# EasyEDA Pro project AnalyzerBoxPCB_fork_EasyEDA.epro

# Board PCB1
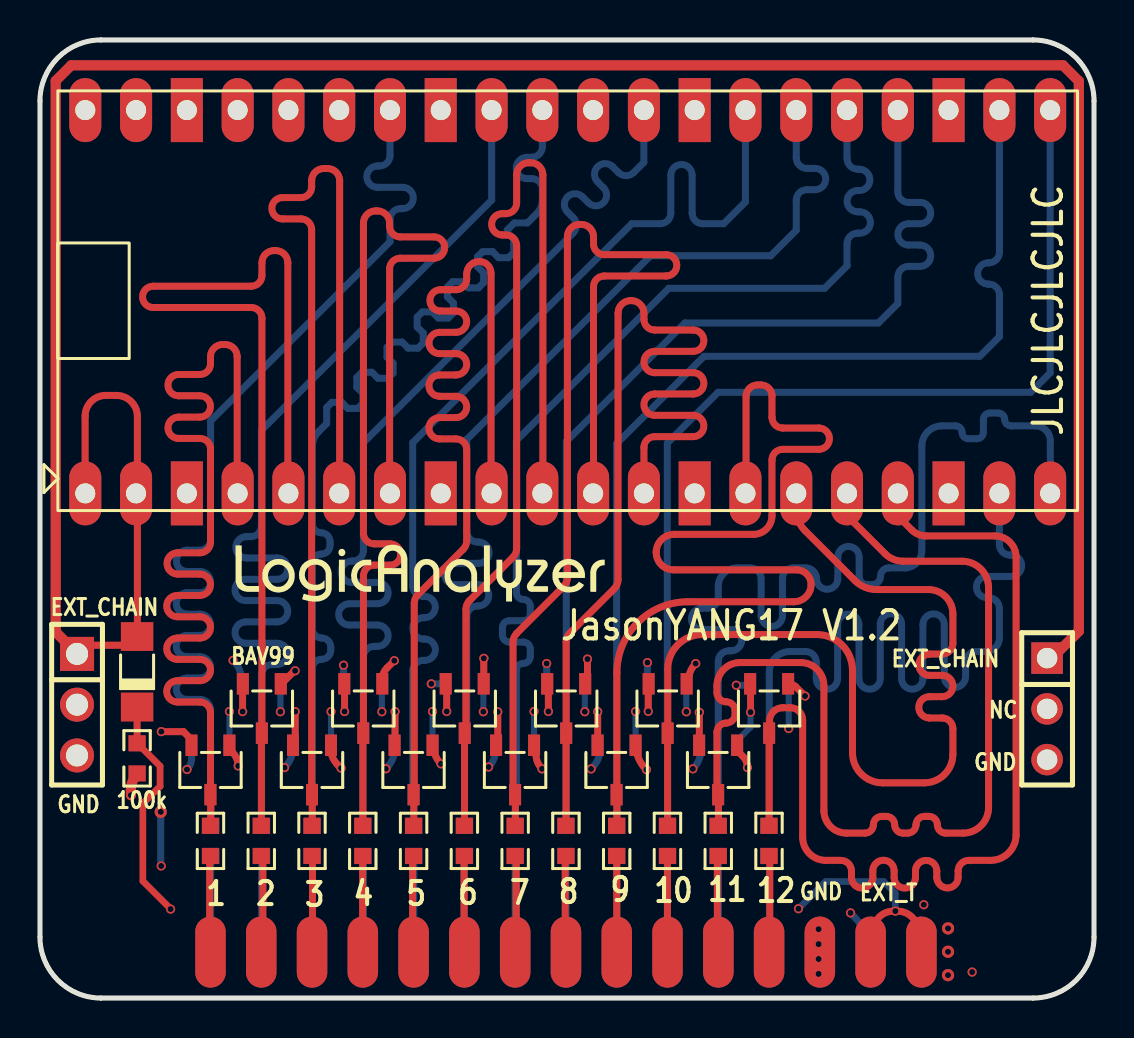
[diagram p0: board, top side]
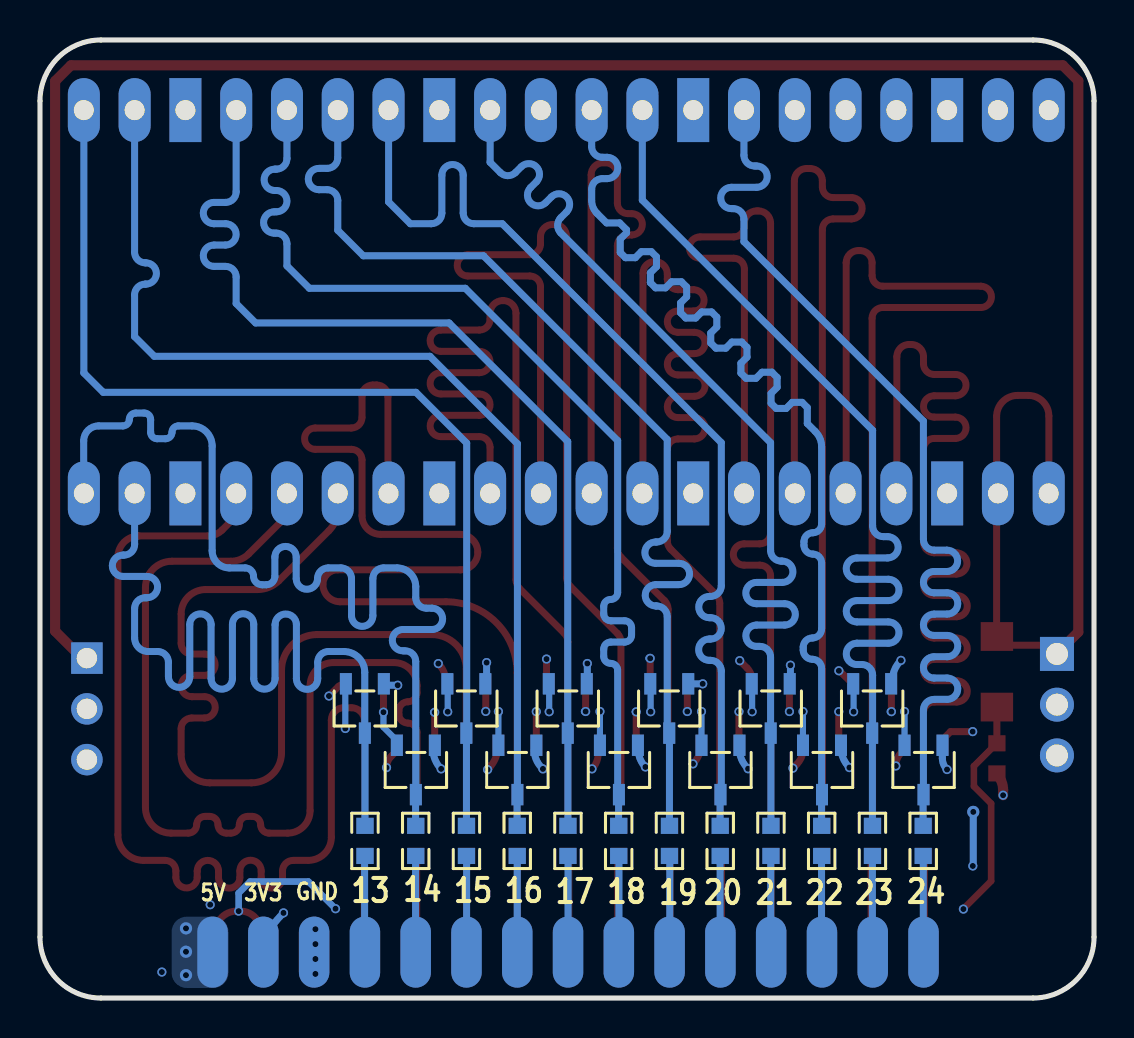
[diagram p1: board, bottom side, seen from below]

Outline 52.72 x 47.94 mm; copper layers: Top Layer, Inner1, Inner2, Bottom Layer. Coordinates in mm from the lower left corner of the outline.
Outline path: 0,44.9 arc(0.89,47.05) 3.05,47.94 49.67,47.94 arc(51.83,47.05) 52.72,44.9 52.72,3.05 arc(51.83,0.89) 49.67,0 3.05,0 arc(0.89,0.89) 0,3.05 0,44.9
Stack: Top Layer 0.035mm 外层铜厚1oz / Dielectric1 0.2104mm 7628 RC49% 8.6mil / Inner1 0.0152mm 内层铜厚 / Dielectric2 1.065mm 1.1mm H/HOZ 含铜 / Inner2 0.0152mm 内层铜厚 / Dielectric3 0.2104mm 7628 RC49% 8.6mil / Bottom Layer 0.035mm 外层铜厚1oz

## Design rules (mm)
template: 自定义配置
spacing copperThickness1oz (default): track to track 0.102, other pairs 0.152 to 0.3
spacing copperThickness2oz: track to track 0.203, other pairs 0.152 to 0.3
track width copperThickness1oz (default): min 0.127, default 0.254, max 2.54
track width copperThickness2oz: min 0.203, default 0.254, max 2.54
differential pair differentialPair (default): width min 0.127, default 0.254, max 2.54; gap min 0.152, default 0.152
via viaSize (default): diameter min 0.406, default 0.457, max 10; hole min 0.3, default 0.305, max 6.299

## Placement (name value [footprint] x y rotation side)
D1  BAV99,215  [SOT-23-3_L2.9-W1.6-P1.90-LS2.8-BR]  11.1 14.49 90 top
D2  FDLL4148  [SOD-80_L3.5-W1.5-RD]  4.86 16.33 90 top
D3  BAV99,215  [SOT-23-3_L2.9-W1.6-P1.90-LS2.8-BR]  13.61 11.41 90 top
D4  BAV99,215  [SOT-23-3_L2.9-W1.6-P1.90-LS2.8-BR]  16.17 14.49 90 top
D5  BAV99,215  [SOT-23-3_L2.9-W1.6-P1.90-LS2.8-BR]  18.68 11.41 90 top
D6  BAV99,215  [SOT-23-3_L2.9-W1.6-P1.90-LS2.8-BR]  21.25 14.49 90 top
D7  BAV99,215  [SOT-23-3_L2.9-W1.6-P1.90-LS2.8-BR]  23.76 11.41 90 top
D8  BAV99,215  [SOT-23-3_L2.9-W1.6-P1.90-LS2.8-BR]  26.32 14.49 90 top
D9  BAV99,215  [SOT-23-3_L2.9-W1.6-P1.90-LS2.8-BR]  28.84 11.41 90 top
D10  BAV99,215  [SOT-23-3_L2.9-W1.6-P1.90-LS2.8-BR]  31.39 14.49 90 top
D11  BAV99,215  [SOT-23-3_L2.9-W1.6-P1.90-LS2.8-BR]  33.92 11.41 90 top
D12  BAV99,215  [SOT-23-3_L2.9-W1.6-P1.90-LS2.8-BR]  36.47 14.49 90 top
D13  BAV99,215  [SOT-23-3_L2.9-W1.6-P1.90-LS2.8-BR]  36.47 14.49 90 bottom
D14  BAV99,215  [SOT-23-3_L2.9-W1.6-P1.90-LS2.8-BR]  33.92 11.41 90 bottom
D15  BAV99,215  [SOT-23-3_L2.9-W1.6-P1.90-LS2.8-BR]  31.39 14.49 90 bottom
D16  BAV99,215  [SOT-23-3_L2.9-W1.6-P1.90-LS2.8-BR]  28.84 11.41 90 bottom
D17  BAV99,215  [SOT-23-3_L2.9-W1.6-P1.90-LS2.8-BR]  26.32 14.49 90 bottom
D18  BAV99,215  [SOT-23-3_L2.9-W1.6-P1.90-LS2.8-BR]  23.76 11.41 90 bottom
D19  BAV99,215  [SOT-23-3_L2.9-W1.6-P1.90-LS2.8-BR]  21.25 14.49 90 bottom
D20  BAV99,215  [SOT-23-3_L2.9-W1.6-P1.90-LS2.8-BR]  18.68 11.41 90 bottom
D21  BAV99,215  [SOT-23-3_L2.9-W1.6-P1.90-LS2.8-BR]  16.17 14.49 90 bottom
D22  BAV99,215  [SOT-23-3_L2.9-W1.6-P1.90-LS2.8-BR]  13.61 11.41 90 bottom
D23  BAV99,215  [SOT-23-3_L2.9-W1.6-P1.90-LS2.8-BR]  11.1 14.49 90 bottom
D24  BAV99,215  [SOT-23-3_L2.9-W1.6-P1.90-LS2.8-BR]  8.53 11.41 90 bottom
D25  BAV99,215  [SOT-23-3_L2.9-W1.6-P1.90-LS2.8-BR]  8.53 11.41 90 top
H1  -  [HDR-TH_3P-P2.54-V-F]  50.37 14.47 270 top
H2  -  [HDR-TH_3P-P2.54-V-M]  1.85 14.68 270 top
R1  100kΩ  [R0603]  4.86 11.99 90 top
R2  220Ω  [R0603]  8.53 7.86 270 top
R3  220Ω  [R0603]  11.07 7.86 270 top
R4  220Ω  [R0603]  13.61 7.86 270 top
R5  220Ω  [R0603]  16.15 7.86 270 top
R6  220Ω  [R0603]  18.69 7.86 270 top
R7  220Ω  [R0603]  21.23 7.86 270 top
R8  220Ω  [R0603]  23.77 7.86 270 top
R9  220Ω  [R0603]  26.31 7.86 270 top
R10  220Ω  [R0603]  28.85 7.86 270 top
R11  220Ω  [R0603]  31.38 7.86 270 top
R12  220Ω  [R0603]  33.93 7.86 270 top
R13  220Ω  [R0603]  36.46 7.86 270 top
R14  220Ω  [R0603]  8.55 7.86 90 bottom
R15  220Ω  [R0603]  11.08 7.86 90 bottom
R16  220Ω  [R0603]  13.62 7.86 90 bottom
R17  220Ω  [R0603]  16.16 7.86 90 bottom
R18  220Ω  [R0603]  18.7 7.86 90 bottom
R19  220Ω  [R0603]  21.24 7.86 90 bottom
R20  220Ω  [R0603]  23.77 7.86 90 bottom
R21  220Ω  [R0603]  26.31 7.86 90 bottom
R22  220Ω  [R0603]  28.85 7.86 90 bottom
R23  220Ω  [R0603]  31.39 7.86 90 bottom
R24  220Ω  [R0603]  33.93 7.86 90 bottom
R25  220Ω  [R0603]  36.46 7.86 90 bottom
U2  -  [树莓派pico多层]  51.8 24.39 90 top
U3  双排针母座2.54 2*15P  [HDR-TH_30P-P2.54-V-F-R2-C15-S2.54-A]  24.98 1.96 90 top

## Footprints (pads in the part's own frame, mm; a bottom-side part is the same pattern mirrored in y, then rotated)
HDR-TH_3P-P2.54-V-F
  rect 1.575x1.575 hole 1.02: 1(-2.54,0)
  round 1.575 hole 1.02: 2(0,0) 3(2.54,0)
HDR-TH_3P-P2.54-V-M
  rect 1.7x1.7 hole 1.1: 1(-2.54,0)
  round 1.7 hole 1.1: 2(0,0) 3(2.54,0)
HDR-TH_30P-P2.54-V-F-R2-C15-S2.54-A
  oval 3.556x1.524 smd: 1(0.337,16.453) 2(0.337,13.914) 3(0.337,11.373) 4(0.337,8.834) 5(0.337,6.293) 6(0.337,3.753) 7(0.337,1.214) 8(0.337,-1.327) 9(0.337,-3.866) 10(0.337,-6.407) 11(0.337,-8.947) 12(0.337,-11.486) 13(0.337,-14.027) 14(0.337,-16.567) 15(0.337,-19.107)
  oval 3.556x1.524 smd far side: 16(0.337,-19.107) 17(0.337,-16.567) 18(0.337,-14.027) 19(0.337,-11.486) 20(0.337,-8.947) 21(0.337,-6.407) 22(0.337,-3.866) 23(0.337,-1.327) 24(0.337,1.214) 25(0.337,3.753) 26(0.337,6.293) 27(0.337,8.834) 28(0.337,11.373) 29(0.337,13.914) 30(0.337,16.453)
R0603
  rect 0.806x0.864 smd: 1(-0.753,0) 2(0.753,0)
SOD-80_L3.5-W1.5-RD
  rect 1.44x1.62 smd: 1(-1.765,0) 2(1.765,0)
SOT-23-3_L2.9-W1.6-P1.90-LS2.8-BR
  rect 1.07x0.6 smd: 1(1.235,-0.95) 2(1.235,0.95) 3(-1.235,0)
树莓派pico多层
  oval 3.2x1.6 hole 1: 1(0.86,49.529) 2(0.86,46.99) 4(0.86,41.91) 5(0.86,39.37) 6(0.86,36.83) 7(0.86,34.289) 9(0.86,29.209) 10(0.86,26.669) 11(0.86,24.13) 12(0.86,21.59) 14(0.86,16.509) 15(0.86,13.97) 16(0.86,11.43) 17(0.86,8.889) 19(0.86,3.809) 20(0.86,1.27) 21(20.04,1.27) 22(20.04,3.809) 24(20.04,8.889) 25(20.04,11.43) 26(20.04,13.97) 27(20.04,16.509) 29(20.04,21.59) 30(20.04,24.13) 31(20.04,26.669) 32(20.04,29.209) 34(20.04,34.289) 35(20.04,36.83) 36(20.04,39.37) 37(20.04,41.91) 39(20.04,46.989) 40(20.04,49.529)
  rect 3.2x1.6 hole 1: 3(0.86,44.45) 8(0.86,31.75) 13(0.86,19.049) 18(0.86,6.349) 23(20.04,6.349) 28(20.04,19.049) 33(20.04,31.75) 38(20.04,44.45)

## Nets
+3.3V: D1.2 D3.2 D4.2 D5.2 D6.2 D7.2 D8.2 D9.2 D10.2 D11.2 D12.2 D13.2 D14.2 D15.2 D16.2 D17.2 D18.2 D19.2 D20.2 D21.2 D22.2 D23.2 D24.2 D25.2 U2.36 U3.17
+5V: U2.40 U3.16
GND: D1.1 D3.1 D4.1 D5.1 D6.1 D7.1 D8.1 D9.1 D10.1 D11.1 D12.1 D13.1 D14.1 D15.1 D16.1 D17.1 D18.1 D19.1 D20.1 D21.1 D22.1 D23.1 D24.1 D25.1 H1.3 H2.3 R1.1 U2.3 U2.8 U2.13 U2.18 U2.23 U2.28 U2.38 U3.13 U3.18
CHAN_0: D25.3 R2.1 U2.4
CHAN_1: D1.3 R3.1 U2.5
CHAN_2: D3.3 R4.1 U2.6
CHAN_3: D4.3 R5.1 U2.7
CHAN_4: D5.3 R6.1 U2.9
CHAN_5: D6.3 R7.1 U2.10
CHAN_6: D7.3 R8.1 U2.11
CHAN_7: D8.3 R9.1 U2.12
CHAN_8: D9.3 R10.1 U2.14
CHAN_9: D10.3 R11.1 U2.15
CHAN_10: D11.3 R12.1 U2.16
CHAN_11: D12.3 R13.1 U2.17
CHAN_12: D13.3 R25.2 U2.19
CHAN_13: D14.3 R24.2 U2.20
CHAN_14: D15.3 R23.2 U2.21
CHAN_15: D16.3 R22.2 U2.22
CHAN_16: D17.3 R21.2 U2.24
CHAN_17: D18.3 R20.2 U2.25
CHAN_18: D19.3 R19.2 U2.26
CHAN_19: D20.3 R18.2 U2.27
CHAN_20: D21.3 R17.2 U2.29
CHAN_21: D22.3 R16.2 U2.31
CHAN_22: D23.3 R15.2 U2.32
CHAN_23: D24.3 R14.2 U2.34
EXT_CHAIN: D2.2 H1.1 H2.1 U2.1 U2.2
EXT_T: D2.1 R1.2 U3.14 U3.15
$1N6412: R2.2 U3.1
$1N6457: R3.2 U3.2
$1N6576: R4.2 U3.3
$1N6580: R5.2 U3.4
$1N6666: R6.2 U3.5
$1N6670: R7.2 U3.6
$1N6756: R8.2 U3.7
$1N6760: R9.2 U3.8
$1N6846: R10.2 U3.9
$1N6850: R11.2 U3.10
$1N6936: R12.2 U3.11
$1N6940: R13.2 U3.12
$1N7395: R25.1 U3.19
$1N7399: R24.1 U3.20
$1N7403: R23.1 U3.21
$1N7407: R22.1 U3.22
$1N7411: R21.1 U3.23
$1N7415: R20.1 U3.24
$1N7419: R19.1 U3.25
$1N7423: R18.1 U3.26
$1N7427: R17.1 U3.27
$1N7431: R16.1 U3.28
$1N7435: R15.1 U3.29
$1N7439: R14.1 U3.30

Pads without a net: H1 2; H2 2; U2 30 33 35 37 39

## Via types
v1: diameter 0.457, hole 0.305, Top Layer to Bottom Layer, 59 vias
v2: diameter 0.61, hole 0.305, Top Layer to Bottom Layer, 4 vias

## Routing (per net, layer and track width the routed paths; a pad name or vN(x,y) marks a point on that pad's centre or on a via; arc(x,y) is an arc through that point)
+3.3V: length 152.4
  Top Layer w0.349: 25.43,15.79 v1(25.43,14.34) ; v1(35.54,14.31) 35.54,15.66 ; 22.82,12.8 22.9,12.89 v1(22.9,14.32) ; 30.42,15.66 v1(30.42,14.34) ; 20.34,15.49 v1(20.34,14.34) ; 17.76,12.7 v1(17.76,14.33) ; 12.65,12.62 12.77,12.74 v1(12.77,14.33) ; 15.23,15.76 v1(15.23,14.34) ; 7.54,12.61 7.54,12.96 7.18,13.33 v1(6.07,13.33) ; 27.9,12.7 v1(27.9,14.33) ; 10.13,15.75 v1(10.13,14.33) ; 32.98,12.57 v1(32.98,14.3)
  Inner2 w0.349: v1(6.06,6.61) 7.01,5.66 39.14,5.66 v1(40.54,4.26)
  Inner2 w0.508: 6.05,13.01 6.05,15.65 ; 6.05,13.01 6.05,9.33 v2(6.04,9.31) ; 6.05,13.01 arc(6.06,13.17) 6.09,13.33 arc(6.56,14.05) 7.37,14.33 arc(6.44,14.72) 6.05,15.65 ; 6.05,15.65 6.05,34.87 12.43,41.24 12.43,44.43
  Inner2 w0.762: v1(37.45,13.49) 36.61,14.33 v1(27.25,14.33) 6.4,14.33
  Bottom Layer w0.305: v1(19.63,14.34) 19.63,12.51 ; v1(17.1,14.33) 17.1,15.71 17.12,15.73 ; v1(37.45,13.49) 37.45,15.7 37.42,15.73 ; v1(9.48,14.34) 9.48,12.51 ; 27.27,15.73 27.25,15.71 v1(27.25,14.33) ; v1(35.54,14.31) 35.54,13.56 34.87,12.88 34.87,12.51 ; 32.34,15.72 32.33,15.71 v1(32.33,14.33) ; v1(12.02,14.33) 12.02,15.71 12.04,15.72 ; v1(29.79,14.34) 29.79,12.51 ; v1(14.56,14.34) 14.56,12.51 ; 22.19,15.73 22.18,15.71 v1(22.18,14.33) ; v1(24.71,14.34) 24.71,12.51
  Bottom Layer w0.349: v1(25.43,14.34) 25.49,14.34 ; v1(10.13,14.33) 10.2,14.33 ; v1(32.98,14.3) 33.04,14.3 ; v1(12.77,14.33) 12.78,14.33 ; v2(6.04,9.31) 6.04,6.63 v1(6.06,6.61) ; v1(17.76,14.33) 17.78,14.33 ; v1(22.9,14.32) 22.95,14.32 ; v1(20.34,14.34) 20.33,14.34 ; v1(6.07,13.33) 6.07,13.31 ; v1(27.9,14.33) 27.9,14.33 ; v1(40.54,4.26) arc(41.11,3.61) 41.57,2.88
+5V: length 82.8
  Inner2 w0.508: v2(45.42,3.49) 45.42,5.19 43.62,6.99 7.83,6.99 7.02,7.79 4.62,7.79 3.5,8.91 3.5,42.34 2.14,43.7
  Inner2 w0.61: v2(45.42,1.15) v2(45.42,2.32) v2(45.42,3.49)
GND: length 27.6
  Top Layer w0.349: 12.1,15.75 12.67,16.32 arc(12.72,16.35) 12.78,16.36 ; v1(30.33,11.43) 30.29,11.47 arc(29.94,12) 29.81,12.64 ; v1(34.83,15.65) 34.83,15.68 ; 27.38,15.93 v1(27.38,16.96) ; v1(15.06,11.5) 14.88,11.68 arc(14.63,12.06) 14.54,12.5 ; v1(19.57,15.72) 19.57,15.7 ; v1(25.34,16.74) 25.33,16.74 ; 9.43,12.5 9.63,12.3 arc(9.84,11.98) v1(9.91,11.61) ; 22.2,15.81 v1(22.2,17) ; 32.43,15.71 32.43,15.86 arc(32.53,16.33) v1(32.8,16.74) ; v1(9.66,16.9) 9.65,16.9 ; 24.81,12.54 24.81,12.21 arc(24.88,11.81) v1(25.11,11.47) ; v1(30.38,16.79) 30.43,16.79 ; 34.82,12.43 35.15,12.1 arc(35.33,11.84) v1(35.39,11.53) ; v1(38.27,15.11) 37.8,15.58 arc(37.65,15.68) 37.48,15.71 ; v1(17.72,16.88) 17.36,16.52 arc(17.16,16.23) 17.1,15.89 ; 19.66,12.69 arc(19.76,12.16) v1(20.06,11.72)
  Top Layer w0.508: v1(4.55,10.15) 4.55,10.41 arc(4.64,10.85) 4.89,11.23
  Bottom Layer w0.349: 12.66,12.58 12.66,12.57 arc(12.55,12.01) v1(12.23,11.53) ; 20.26,15.72 v1(19.57,15.72) ; 22.79,12.5 22.79,12.41 arc(22.7,11.95) v1(22.44,11.56) ; 30.38,15.61 v1(30.38,16.79) ; 15.18,15.67 v1(15.18,16.66) ; 33.06,12.67 33.06,12.45 arc(32.96,11.92) v1(32.66,11.47) ; 25.34,15.77 v1(25.34,16.74) ; v1(27.56,11.47) 27.62,11.52 arc(27.9,11.95) 28,12.44 ; v1(27.38,16.96) 27.34,16.96 ; 7.59,12.69 7.59,12 arc(7.53,11.7) v1(7.35,11.44) ; v1(22.2,17) 22.27,17 ; v1(9.66,16.9) 9.67,16.89 arc(9.98,16.42) 10.09,15.87 ; 35.57,15.65 v1(34.83,15.65) ; v1(17.3,11.47) 17.32,11.5 arc(17.64,11.97) 17.75,12.53
  vias: v1(12.76,16.38) v1(38.94,3.45) v1(38.94,2.7) v1(38.94,1.95) v1(38.94,1.21) v1(44.21,4.67) v1(46.62,1.3)
CHAN_0: length 53.1
  Top Layer w0.349: 8.54,8.62 8.54,10.19 ; 9.86,25.27 9.86,32.1 arc(9.68,32.53) 9.25,32.71 9.14,32.71 arc(8.71,32.53) 8.53,32.1 8.53,31.74 arc(8.37,31.36) 8,31.21 6.93,31.21 arc(6.4,30.67) 6.93,30.14 8,30.14 arc(8.53,29.6) 8,29.07 6.93,29.07 arc(6.4,28.54) 6.93,28 8,28 arc(8.37,27.85) 8.53,27.47 8.53,22.81 arc(8.37,22.44) 8,22.28 6.89,22.28 arc(6.35,21.75) 6.89,21.21 8,21.21 arc(8.53,20.68) 8,20.15 6.87,20.15 arc(6.34,19.61) 6.87,19.08 8,19.08 arc(8.53,18.55) 8,18.01 6.87,18.01 arc(6.34,17.48) 6.87,16.95 8,16.95 arc(8.53,16.41) 8,15.88 6.87,15.88 arc(6.34,15.35) 6.87,14.81 8,14.81 arc(8.37,14.66) 8.53,14.28 8.53,9.94
CHAN_1: length 53.1
  Top Layer w0.349: 12.4,25.25 12.4,36.8 arc(12.22,37.23) 11.79,37.41 11.71,37.41 arc(11.28,37.23) 11.1,36.8 11.1,36.16 arc(10.94,35.78) 10.57,35.62 5.66,35.62 arc(5.13,35.09) 5.66,34.56 10.57,34.56 arc(10.94,34.4) 11.1,34.02 11.1,12.9 ; 11.07,8.62 11.07,13.27
CHAN_2: length 53.1
  Top Layer w0.349: 14.99,25.27 14.99,40.9 arc(14.81,41.33) 14.38,41.51 14.2,41.51 arc(13.77,41.33) 13.59,40.9 13.59,40.59 arc(13.43,40.21) 13.05,40.06 12.13,40.06 arc(11.6,39.52) 12.13,38.99 13.05,38.99 arc(13.43,38.83) 13.59,38.46 13.59,10.17 ; 13.62,8.62 13.62,10.19
CHAN_3: length 53.1
  Top Layer w0.349: 16.15,8.62 16.15,13.26 ; 16.15,13.26 16.18,13.28 16.18,21.13 arc(16.33,21.51) 16.71,21.66 17.51,21.66 arc(18.04,22.2) 17.51,22.73 16.71,22.73 arc(16.33,22.89) 16.18,23.26 16.18,38.78 arc(16.36,39.21) 16.79,39.39 16.88,39.39 arc(17.31,39.21) 17.49,38.78 17.49,38.62 arc(17.64,38.25) 18.02,38.09 19.71,38.09 arc(20.24,37.56) 19.71,37.02 18.02,37.02 arc(17.64,36.87) 17.49,36.49 17.49,25.26 ; 16.15,13.26 16.13,13.24
CHAN_4: length 53.1
  Top Layer w0.349: 22.56,25.31 22.56,36.27 arc(22.39,36.69) 21.97,36.86 arc(21.53,36.67) 21.34,36.23 21.34,35.98 arc(21.19,35.6) 20.81,35.45 20.04,35.45 arc(19.5,34.91) 20.04,34.38 20.81,34.38 arc(21.34,33.85) 20.81,33.31 19.99,33.31 arc(19.46,32.78) 19.99,32.25 20.81,32.25 arc(21.34,31.71) 20.81,31.18 19.99,31.18 arc(19.46,30.65) 19.99,30.11 20.81,30.11 arc(21.34,29.58) 20.81,29.05 19.99,29.05 arc(19.46,28.51) 19.99,27.98 20.81,27.98 arc(21.19,27.82) 21.34,27.45 21.34,22.88 arc(21.3,22.65) 21.16,22.45 18.9,20.18 arc(18.77,19.99) 18.72,19.75 18.72,9.95 ; 18.7,8.62 18.7,10.19
CHAN_5: length 53.1
  Top Layer w0.349: 21.23,8.62 21.23,13.27 ; 25.15,25.26 25.15,41.19 arc(24.98,41.62) 24.54,41.8 24.45,41.8 arc(24.02,41.62) 23.84,41.19 23.84,39.79 arc(23.68,39.41) 23.31,39.25 23.12,39.25 arc(22.59,38.72) 23.12,38.19 23.31,38.19 arc(23.68,38.03) 23.84,37.65 23.84,22.5 arc(23.79,22.26) 23.66,22.07 21.48,19.89 arc(21.35,19.69) 21.3,19.46 21.3,13.26
CHAN_6: length 53.1
  Top Layer w0.349: 23.78,8.62 23.78,10.19 ; 23.66,9.89 23.66,17.82 arc(23.71,18.05) 23.84,18.25 26.2,20.61 arc(26.33,20.81) 26.38,21.04 26.38,38.1 arc(26.56,38.53) 26.99,38.71 27.08,38.71 arc(27.51,38.53) 27.69,38.1 27.69,37.73 arc(27.84,37.36) 28.22,37.2 31.32,37.2 arc(31.85,36.67) 31.32,36.13 28.22,36.13 arc(27.84,35.98) 27.69,35.6 27.69,25.27
CHAN_7: length 53.1
  Top Layer w0.349: 30.21,25.23 30.21,27.56 arc(30.36,27.94) 30.74,28.09 32.67,28.09 arc(33.21,28.63) 32.67,29.16 30.74,29.16 arc(30.21,29.69) 30.74,30.23 32.67,30.23 arc(33.21,30.76) 32.67,31.29 30.74,31.29 arc(30.21,31.83) 30.74,32.36 32.67,32.36 arc(33.21,32.9) 32.67,33.43 30.74,33.43 arc(30.36,33.58) 30.21,33.96 30.21,34.27 arc(30.02,34.72) 29.57,34.9 29.55,34.9 arc(29.1,34.72) 28.91,34.27 28.91,20.93 arc(28.86,20.69) 28.73,20.49 26.5,18.26 arc(26.37,18.06) 26.32,17.81 26.32,13.13 ; 26.31,8.62 26.31,13.27
CHAN_8: length 53.2
  Top Layer w0.349: 28.86,10.17 28.86,16.28 arc(29.9,18.79) 32.41,19.83 37.7,19.83 arc(38.31,20.08) 38.57,20.69 arc(38.35,21.21) 37.84,21.43 31.69,21.43 arc(31.08,21.68) 30.82,22.3 arc(31.08,22.94) 31.72,23.2 35.68,23.2 arc(36.34,23.48) 36.61,24.14 36.61,26.93 arc(36.77,27.3) 37.15,27.46 38.95,27.46 arc(39.49,27.99) 38.95,28.53 37.15,28.53 arc(36.77,28.68) 36.61,29.06 36.61,30.14 arc(36.45,30.52) 36.07,30.68 35.88,30.68 arc(35.48,30.51) 35.32,30.11 35.32,25.19 ; 28.86,10.17 28.91,10.12 ; 28.86,10.17 28.86,8.62
CHAN_9: length 53.1
  Top Layer w0.349: 31.4,13.31 31.4,16.46 arc(31.91,17.68) 33.13,18.19 38.86,18.19 arc(40.12,17.67) 40.64,16.41 40.64,12.28 arc(41.08,11.21) 42.14,10.77 44.23,10.77 arc(45.24,11.19) 45.66,12.2 45.66,13.48 arc(45.5,13.86) 45.13,14.01 44.49,14.01 arc(43.95,14.55) 44.49,15.08 45.13,15.08 arc(45.66,15.61) 45.13,16.15 44.49,16.15 arc(43.96,16.68) 44.49,17.21 45.13,17.21 arc(45.5,17.37) 45.66,17.75 45.66,19.22 arc(45.3,20.08) 44.44,20.44 41.84,20.44 arc(41.26,20.56) 40.77,20.89 38.27,23.38 arc(37.94,23.88) 37.83,24.46 U2.15 ; 31.39,8.62 31.39,13.27
CHAN_10: length 53.1
  Top Layer w0.349: U2.16 40.37,24.66 arc(40.46,24.18) 40.74,23.77 42.27,22.23 arc(42.69,21.96) 43.17,21.86 46.12,21.86 arc(47.06,21.47) 47.44,20.54 47.44,9.53 arc(47.07,8.63) 46.17,8.25 45.3,8.25 arc(45.01,8.37) 44.88,8.67 arc(44.76,8.97) 44.46,9.09 44.24,9.09 arc(43.94,8.97) 43.82,8.67 arc(43.69,8.37) 43.4,8.25 43.17,8.25 arc(42.87,8.37) 42.75,8.67 arc(42.63,8.97) 42.33,9.09 42.1,9.09 arc(41.81,8.97) 41.68,8.67 arc(41.56,8.37) 41.26,8.25 40.34,8.25 arc(39.54,8.58) 39.21,9.38 39.21,15.62 arc(38.87,16.45) 38.04,16.79 35.02,16.79 arc(34.2,16.45) 33.86,15.63 33.86,15.28 arc(33.99,14.96) 34.32,14.83 arc(34.64,14.69) 34.77,14.37 34.77,14.21 arc(34.64,13.89) 34.32,13.76 arc(33.99,13.63) 33.86,13.31 33.86,10.37 ; 33.94,8.62 33.94,10.19
CHAN_11: length 53
  Top Layer w0.349: U2.17 42.91,24.54 arc(42.98,24.16) 43.2,23.83 43.61,23.42 arc(43.94,23.2) 44.33,23.12 47.76,23.12 arc(48.51,22.81) 48.82,22.07 48.82,8.17 arc(48.45,7.26) 47.54,6.89 46.46,6.89 arc(46.08,6.73) 45.92,6.36 45.92,6.04 arc(45.39,5.5) 44.86,6.04 44.86,6.36 arc(44.32,6.89) 43.79,6.36 43.79,6.04 arc(43.26,5.5) 42.72,6.04 42.72,6.36 arc(42.19,6.89) 41.66,6.36 41.66,6.04 arc(41.12,5.5) 40.59,6.04 40.59,6.36 arc(40.43,6.73) 40.06,6.89 39.31,6.89 arc(38.49,7.23) 38.15,8.05 38.15,13.91 arc(37.97,14.35) 37.53,14.53 37.14,14.53 arc(36.68,14.34) 36.49,13.88 36.49,13.24 ; 36.47,8.62 36.47,13.26
CHAN_12: length 53.1
  Bottom Layer w0.349: 47.99,25.25 47.99,22.7 arc(48.14,22.32) 48.52,22.17 48.57,22.17 arc(49.1,21.63) 48.57,21.1 47.37,21.1 arc(46.84,20.57) 47.37,20.03 47.45,20.03 arc(47.83,19.88) 47.99,19.5 47.99,18.01 arc(47.79,17.54) 47.31,17.34 46.83,17.34 arc(46.45,17.18) 46.3,16.81 46.3,16.08 arc(45.76,15.55) 45.23,16.08 45.23,18.69 arc(44.7,19.22) 44.16,18.69 44.16,15.99 arc(43.63,15.46) 43.09,15.99 43.09,18.69 arc(42.56,19.22) 42.03,18.69 42.03,15.99 arc(41.5,15.46) 40.96,15.99 40.96,18.69 arc(40.43,19.22) 39.9,18.69 39.89,15.99 arc(39.36,15.46) 38.83,15.99 38.83,16.81 arc(38.67,17.18) 38.29,17.34 37.52,17.34 arc(36.78,17.03) 36.48,16.3 36.48,13.26 ; 36.47,8.62 36.47,13.29
CHAN_13: length 53.1
  Bottom Layer w0.349: 33.93,8.62 33.93,10.18 ; 33.93,10.19 33.93,16.84 arc(34.08,17.22) 34.46,17.37 34.56,17.37 arc(35.1,17.91) 34.56,18.44 33.11,18.44 arc(32.58,18.98) 33.11,19.51 33.39,19.51 arc(33.77,19.66) 33.93,20.04 33.93,20.59 arc(34.2,21.25) 34.86,21.52 35.54,21.52 arc(35.91,21.37) 36.07,20.99 36.07,19.14 arc(36.6,18.61) 37.14,19.14 37.14,20.99 arc(37.29,21.37) 37.67,21.52 38.3,21.52 arc(38.68,21.37) 38.84,20.99 38.84,20.98 arc(39.37,20.45) 39.9,20.98 39.9,22.07 arc(40.44,22.6) 40.97,22.07 40.97,21.1 arc(41.09,20.81) 41.39,20.68 41.62,20.68 arc(41.91,20.81) 42.04,21.1 arc(42.16,21.4) 42.46,21.52 43.25,21.52 arc(43.86,21.78) 44.11,22.38 44.11,27.63 arc(44.4,28.34) 45.11,28.63 45.8,28.63 arc(46.02,28.54) 46.12,28.31 arc(46.21,28.08) 46.44,27.99 46.86,27.99 arc(47.09,28.08) 47.19,28.31 47.19,28.95 arc(47.28,29.18) 47.51,29.27 47.93,29.27 arc(48.16,29.18) 48.25,28.95 arc(48.35,28.73) 48.57,28.63 49.79,28.63 arc(50.32,28.41) 50.53,27.89 50.53,25.26
CHAN_14: length 53.1
  Bottom Layer w0.349: 50.53,44.44 50.53,31.28 49.56,30.31 33.91,30.31 31.38,27.77 31.38,13.08 ; 31.39,8.62 31.39,13.29
CHAN_15: length 53.1
  Bottom Layer w0.349: 28.84,10.18 28.84,27.74 33.21,32.11 47,32.11 47.99,33.1 47.99,35.19 arc(47.83,35.57) 47.46,35.73 47.43,35.73 arc(46.9,36.26) 47.43,36.79 47.46,36.79 arc(47.83,36.95) 47.99,37.33 47.99,44.43 ; 28.86,8.62 28.86,10.18
CHAN_16: length 53.1
  Bottom Layer w0.349: 26.31,8.62 26.31,13.29 ; 26.32,13.26 26.32,27.85 32.26,33.78 41.93,33.78 42.91,34.76 42.91,36.08 arc(43.06,36.46) 43.44,36.61 44.02,36.61 arc(44.55,37.15) 44.02,37.68 43.44,37.68 arc(42.91,38.21) 43.44,38.75 44.02,38.75 arc(44.55,39.28) 44.02,39.82 43.44,39.82 arc(43.06,39.97) 42.91,40.35 42.91,44.43
CHAN_17: length 53.1
  Bottom Layer w0.349: 40.37,44.44 40.37,42.01 arc(40.52,41.63) 40.9,41.48 40.98,41.48 arc(41.51,40.94) 40.98,40.41 40.9,40.41 arc(40.37,39.88) 40.9,39.34 41,39.34 arc(41.54,38.81) 41,38.28 40.9,38.28 arc(40.52,38.12) 40.37,37.74 40.37,36.64 39.25,35.52 31.45,35.52 23.83,27.9 23.83,20.3 arc(23.93,20.05) 24.17,19.95 arc(24.42,19.84) 24.52,19.6 24.52,19.23 arc(24.42,18.98) 24.17,18.88 23.48,18.88 arc(23.23,18.78) 23.13,18.53 23.13,18.16 arc(23.23,17.92) 23.48,17.81 24.17,17.81 arc(24.42,17.71) 24.52,17.47 24.52,17.09 arc(24.42,16.85) 24.17,16.75 arc(23.93,16.64) 23.83,16.4 23.83,10.11 ; 23.78,8.62 23.78,10.18
CHAN_18: length 53.1
  Bottom Layer w0.349: 21.35,13.2 21.35,19.09 arc(21.5,19.46) 21.88,19.62 21.91,19.62 arc(22.45,20.15) 21.91,20.69 20.76,20.69 arc(20.23,21.22) 20.76,21.75 21.93,21.75 arc(22.46,22.29) 21.93,22.82 21.88,22.82 arc(21.5,22.98) 21.35,23.35 21.35,27.96 30.54,37.14 36.55,37.14 37.83,38.42 37.83,39.92 arc(37.98,40.3) 38.36,40.45 38.77,40.45 arc(39.3,40.98) 38.77,41.52 38.36,41.52 arc(37.98,41.67) 37.83,42.05 37.83,44.43 ; 21.24,8.62 21.24,13.29
CHAN_19: length 53.1
  Bottom Layer w0.349: 35.28,44.43 35.28,39.84 34.19,38.75 33.15,38.75 arc(32.78,38.9) 32.62,39.28 32.62,41.18 arc(32.09,41.71) 31.55,41.18 31.55,39.28 arc(31.4,38.9) 31.02,38.75 29.6,38.75 18.64,27.79 18.64,20.63 arc(18.8,20.26) 19.18,20.1 19.24,20.1 arc(19.77,19.57) 19.24,19.03 19.18,19.03 arc(18.64,18.5) 19.18,17.97 19.24,17.97 arc(19.78,17.43) 19.24,16.9 19.18,16.9 arc(18.8,16.74) 18.64,16.37 18.64,10.2 ; 18.7,8.62 18.7,10.18
CHAN_20: length 53.1
  Bottom Layer w0.349: 16.16,8.62 16.16,13.29 ; 30.21,44.43 30.21,41.82 29.69,41.31 arc(29.32,41.15) 28.94,41.31 28.65,41.6 arc(27.89,41.6) 27.89,40.85 28.18,40.55 arc(28.18,39.8) 27.43,39.8 27.14,40.09 arc(26.38,40.09) 26.38,39.34 26.68,39.05 arc(26.83,38.67) 26.68,38.29 16.18,27.79 16.18,22.4 arc(16.02,22.02) 15.64,21.87 15.59,21.87 arc(15.06,21.33) 15.59,20.8 16.88,20.8 arc(17.42,20.27) 16.88,19.73 15.47,19.73 arc(14.94,19.2) 15.47,18.67 16.88,18.67 arc(17.42,18.13) 16.88,17.6 16.71,17.6 arc(16.33,17.44) 16.18,17.06 16.18,13.25
CHAN_21: length 53.1
  Bottom Layer w0.349: 25.13,44.44 25.13,42.61 arc(24.97,42.23) 24.59,42.07 24.35,42.07 arc(23.82,41.54) 24.35,41.01 24.59,41.01 arc(24.97,40.85) 25.13,40.47 25.13,39.92 arc(25.06,39.56) 24.85,39.26 24.38,38.79 23.73,38.79 23.38,38.44 23.38,38.3 23.7,37.98 23.7,37.31 23.44,37.05 22.94,37.05 22.64,37.35 22.14,37.35 21.88,37.09 21.88,36.6 22.19,36.29 22.19,35.8 21.93,35.54 21.43,35.54 21.13,35.84 20.64,35.84 20.38,35.58 20.38,35.09 20.68,34.78 20.68,34.29 20.42,34.03 19.93,34.03 19.62,34.33 19.13,34.33 18.87,34.07 18.87,33.58 19.17,33.28 19.17,32.78 18.91,32.52 18.42,32.52 18.11,32.83 17.62,32.83 17.36,32.57 17.36,32.07 17.66,31.77 17.66,31.27 17.4,31.01 16.91,31.01 16.6,31.32 16.11,31.32 15.85,31.06 15.85,30.56 16.15,30.26 16.15,29.76 15.89,29.5 15.4,29.5 15.09,29.81 14.6,29.81 14.34,29.55 14.34,28.75 13.94,28.35 arc(13.71,28) 13.62,27.59 13.62,23.72 arc(13.75,23.41) 14.07,23.28 arc(14.38,23.15) 14.51,22.84 14.51,22.66 arc(14.38,22.35) 14.07,22.22 arc(13.75,22.09) 13.62,21.77 13.62,18.48 arc(13.76,18.15) 14.09,18.02 arc(14.41,17.88) 14.55,17.56 14.55,17.41 arc(14.41,17.09) 14.09,16.95 arc(13.76,16.82) 13.62,16.49 13.62,10.38 ; 13.63,8.62 13.63,10.18
CHAN_22: length 53.1
  Bottom Layer w0.349: 11.07,13.31 11.07,16.16 arc(11.23,16.53) 11.61,16.69 11.86,16.69 arc(12.39,17.22) 11.86,17.76 10.29,17.76 arc(9.75,18.29) 10.29,18.82 11.86,18.82 arc(12.39,19.36) 11.86,19.89 10.29,19.89 arc(9.75,20.42) 10.29,20.96 11.86,20.96 arc(12.39,21.49) 11.86,22.02 10.33,22.02 arc(9.8,22.56) 10.33,23.09 10.54,23.09 arc(10.92,23.25) 11.07,23.62 11.07,28.41 22.59,39.93 22.59,44.44 ; 11.08,13.29 11.08,8.62
CHAN_23: length 53.1
  Bottom Layer w0.349: 17.51,44.44 17.51,42.17 arc(17.35,41.79) 16.98,41.64 16.88,41.64 arc(16.35,41.1) 16.88,40.57 18.14,40.57 arc(18.67,40.04) 18.14,39.5 18.04,39.5 arc(17.67,39.35) 17.51,38.97 17.51,37.85 8.53,28.87 8.53,22.95 arc(8.38,22.57) 8,22.41 7.36,22.41 arc(6.82,21.88) 7.36,21.35 8,21.35 arc(8.53,20.81) 8,20.28 7.35,20.28 arc(6.81,19.75) 7.35,19.21 8,19.21 arc(8.53,18.68) 8,18.15 7.35,18.15 arc(6.81,17.61) 7.35,17.08 8,17.08 arc(8.53,16.55) 8,16.01 7.35,16.01 arc(6.81,15.48) 7.35,14.95 8,14.95 arc(8.38,14.79) 8.53,14.41 8.53,9.98 ; 8.55,8.62 8.55,10.18
EXT_CHAIN: length 131.5
  Top Layer w0.349: 4.42,17.66 2.17,17.66 ; 4.87,25.48 4.87,29.1 arc(4.56,29.85) 3.82,30.16 3.29,30.16 arc(2.56,29.85) 2.26,29.12 2.26,25.25 ; 4.87,18 4.87,25.44
  Top Layer w0.508: 50.55,16.95 51.96,18.36 51.96,45.88 51.17,46.68 1.56,46.68 0.79,45.9 0.79,18.31 1.87,17.23
EXT_T: length 52.8
  Top Layer w0.33: 5.07,12.55 6.01,11.61 6.01,10.59 5.15,9.73 5.15,5.85 6.53,4.47 v1(6.53,4.45)
  Top Layer w0.349: 4.86,12.75 4.86,14.68 ; 41.68,3.34 arc(41.98,4.05) 42.69,4.35 42.88,4.35 arc(43.63,4.04) 43.94,3.28
  Inner2 w0.33: v1(6.53,4.45) 6.55,4.47 v1(37.94,4.47)
  Bottom Layer w0.33: v1(37.94,4.47) 39.3,5.83 42.21,5.83 42.78,5.25 v1(42.78,4.35)
$1N6412: length 4.8
  Top Layer w0.349: 8.49,2.28 8.49,7.08
$1N6457: length 4.6
  Top Layer w0.349: 11.15,2.42 11.15,6.98
$1N6576: length 4
  Top Layer w0.349: 13.67,7.14 13.63,7.09 13.63,3.22 13.67,3.17
$1N6580: length 4.6
  Top Layer w0.349: 16.14,2.41 16.14,7
$1N6666: length 4.1
  Top Layer w0.349: 18.63,2.96 18.63,7.02
$1N6670: length 4.6
  Top Layer w0.349: 21.21,2.47 21.21,7.03
$1N6756: length 4.3
  Top Layer w0.349: 23.82,2.74 23.82,7.02
$1N6760: length 3.8
  Top Layer w0.349: 26.27,3.16 26.27,7
$1N6846: length 4
  Top Layer w0.349: 28.73,3.08 28.85,3.19 28.85,7.07
$1N6850: length 4.6
  Top Layer w0.349: 31.48,2.56 31.38,2.65 31.38,7.1
$1N6936: length 4.3
  Top Layer w0.349: 33.88,2.7 33.88,7.02
$1N6940: length 4.1
  Top Layer w0.349: 36.5,2.91 36.5,7.02
$1N7395: length 4.8
  Bottom Layer w0.349: 36.48,2.31 36.48,7.12
$1N7399: length 4.8
  Bottom Layer w0.349: 33.94,2.32 33.94,7.17
$1N7403: length 4.8
  Bottom Layer w0.349: 31.38,2.25 31.38,7.05
$1N7407: length 4.7
  Bottom Layer w0.349: 28.85,2.25 28.85,6.95
$1N7411: length 4.7
  Bottom Layer w0.349: 26.31,2.28 26.31,7.01
$1N7415: length 4.8
  Bottom Layer w0.349: 23.76,2.3 23.76,7.09
$1N7419: length 4.9
  Bottom Layer w0.349: 21.22,2.29 21.22,7.14
$1N7423: length 4.8
  Bottom Layer w0.349: 18.7,2.28 18.7,7.08
$1N7427: length 4.7
  Bottom Layer w0.349: 16.17,2.28 16.17,6.98
$1N7431: length 4.7
  Bottom Layer w0.349: 13.63,2.3 13.63,7.04
$1N7435: length 4.8
  Bottom Layer w0.349: 11.08,2.33 11.08,7.12
$1N7439: length 4.9
  Bottom Layer w0.349: 8.54,2.32 8.54,7.17

## Copper pours and planes (outline as drawn; the poured copper is in the pictures)
+5V on Bottom Layer: 43.29,4.07 46.14,4.07 46.14,0.5 43.29,0.5
GND on Inner1: 6.94,25.65 7.75,25.65 7.75,22.99 6.94,22.99
GND on Inner1: 19.64,27.51 20.45,27.51 20.45,24.85 19.64,24.85
GND on Inner1: 49.98,12.32 50.77,12.32 50.77,10.49 49.98,10.49
GND on Inner1: 32.34,46.69 33.15,46.69 33.15,44.03 32.34,44.03
GND on Inner1: 45.04,27.51 45.85,27.51 45.85,24.85 45.04,24.85
GND on Inner1: 45.04,44.83 45.85,44.83 45.85,42.17 45.04,42.17
GND on Inner1: 45.04,25.65 45.85,25.65 45.85,22.99 45.04,22.99
GND on Inner1: 49.98,13.37 50.77,13.37 50.77,11.54 49.98,11.54
GND on Inner1: 6.94,46.69 7.75,46.69 7.75,44.03 6.94,44.03
GND on Inner1: 32.34,25.65 33.15,25.65 33.15,22.99 32.34,22.99
GND on Inner1: 1.02,46.93 51.7,46.93 51.7,1.02 1.02,1.02
GND on Inner1: 6.94,27.51 7.75,27.51 7.75,24.85 6.94,24.85
GND on Inner1: 48.93,12.33 50.77,12.33 50.77,11.53 48.93,11.53
GND on Inner1: 1.43,12.57 3.39,12.57 3.39,11.71 1.43,11.71
GND on Inner1: 19.64,25.65 20.45,25.65 20.45,22.99 19.64,22.99
GND on Inner1: 6.94,44.83 7.75,44.83 7.75,42.17 6.94,42.17
GND on Inner1: 45.04,46.69 45.85,46.69 45.85,44.03 45.04,44.03
GND on Inner1: 32.34,27.51 33.15,27.51 33.15,24.85 32.34,24.85
GND on Inner1: 1.43,12.57 2.28,12.57 2.28,10.61 1.43,10.61
GND on Inner1: 32.34,44.83 33.15,44.83 33.15,42.17 32.34,42.17
GND on Inner2: -1.14,-1.52 -1.14,53.38 53.76,53.38 53.76,-1.52

## Text on the board
Bottom Silkscreen Layer: GND | 3V3 | 5V | 24 | 23 | 22 | 21 | 20 | 19 | 18 | 17 | 16 | 15 | 14 | 13
Top Silkscreen Layer: 100k | BAV99 | GND | EXT_T | EXT_CHAIN | NC | 6 | 7 | 8 | 9 | 10 | 11 | 12 | 1 | 2 | 3 | 4 | 5 | JasonYANG17 V1.2 | JLCJLCJLCJLC
